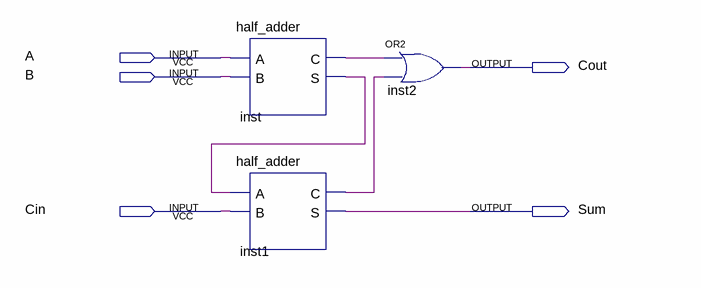
[diagram p0: schematic sheet]
// Quartus schematic full_adder.bdf as structural Verilog: 3 symbols, 5 pins
module full_adder (
  input  A,
  input  B,
  input  Cin,
  output Cout,
  output Sum
);

  wire inst1_c, inst_c, inst_s;

  half_adder inst (.A(A), .B(B), .C(inst_c), .S(inst_s));
  half_adder inst1 (.A(inst_s), .B(Cin), .C(inst1_c), .S(Sum));
  or inst2 (Cout, inst_c, inst1_c);
endmodule
